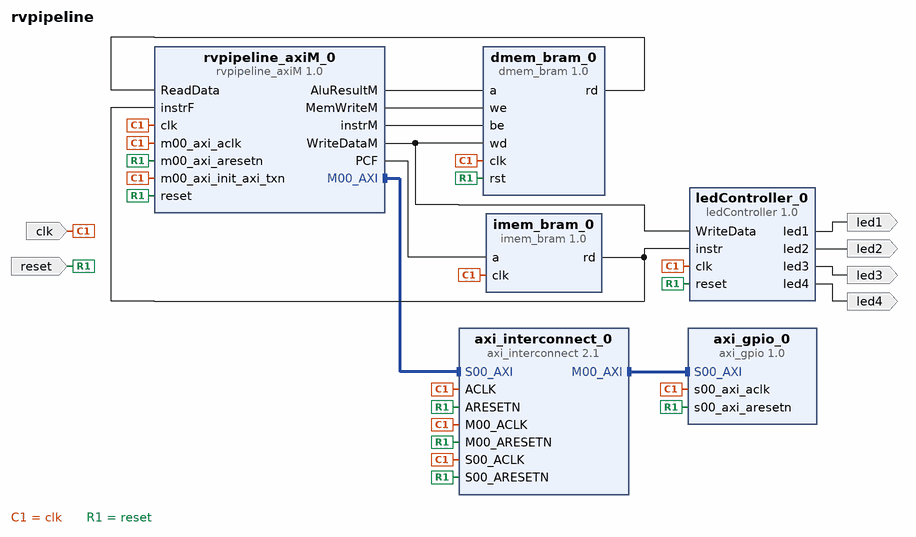
[diagram p0: block diagram of the top level]
# Vivado block design rvpipeline, xc7z010clg400-1, Vivado 2019.2
create_bd_design rvpipeline

create_bd_port -dir I -type clk clk
set_property -dict {CONFIG.FREQ_HZ 50000000} [get_bd_ports clk]
create_bd_port -dir O led3
create_bd_port -dir O led2
create_bd_port -dir O led4
create_bd_port -dir I -type rst reset
set_property -dict {CONFIG.POLARITY ACTIVE_HIGH} [get_bd_ports reset]
create_bd_port -dir O led1

create_bd_cell -type ip -vlnv user.org:user:imem_bram:1.0 imem_bram_0
create_bd_cell -type ip -vlnv user.org:user:dmem_bram:1.0 dmem_bram_0
create_bd_cell -type ip -vlnv xilinx.com:ip:axi_interconnect:2.1 axi_interconnect_0
set_property -dict {CONFIG.NUM_MI 1} [get_bd_cells axi_interconnect_0]
create_bd_cell -type ip -vlnv user.org:user:axi_gpio:1.0 axi_gpio_0
create_bd_cell -type ip -vlnv user.org:user:ledController:1.0 ledController_0
create_bd_cell -type ip -vlnv user.org:user:rvpipeline_axiM:1.0 rvpipeline_axiM_0

# ---- connections ----

connect_bd_intf_net [get_bd_intf_pins axi_interconnect_0/M00_AXI] [get_bd_intf_pins axi_gpio_0/S00_AXI]
connect_bd_intf_net [get_bd_intf_pins rvpipeline_axiM_0/M00_AXI] [get_bd_intf_pins axi_interconnect_0/S00_AXI]
connect_bd_net -net riscvpipeline_0_ALUResultM [get_bd_pins rvpipeline_axiM_0/AluResultM] [get_bd_pins dmem_bram_0/a]
connect_bd_net -net riscvpipeline_0_WriteDataM [get_bd_pins rvpipeline_axiM_0/WriteDataM] \
  [get_bd_pins dmem_bram_0/wd] [get_bd_pins ledController_0/WriteData]
connect_bd_net [get_bd_pins dmem_bram_0/rd] [get_bd_pins rvpipeline_axiM_0/ReadData]
connect_bd_net [get_bd_pins rvpipeline_axiM_0/PCF] [get_bd_pins imem_bram_0/a]
connect_bd_net [get_bd_pins rvpipeline_axiM_0/MemWriteM] [get_bd_pins dmem_bram_0/we]
connect_bd_net [get_bd_pins rvpipeline_axiM_0/instrM] [get_bd_pins dmem_bram_0/be]
connect_bd_net [get_bd_ports clk] \
  [get_bd_pins imem_bram_0/clk] [get_bd_pins axi_interconnect_0/ACLK] [get_bd_pins axi_interconnect_0/M00_ACLK] \
  [get_bd_pins axi_interconnect_0/S00_ACLK] [get_bd_pins dmem_bram_0/clk] [get_bd_pins axi_gpio_0/s00_axi_aclk] \
  [get_bd_pins ledController_0/clk] [get_bd_pins rvpipeline_axiM_0/clk] [get_bd_pins rvpipeline_axiM_0/m00_axi_init_axi_txn] \
  [get_bd_pins rvpipeline_axiM_0/m00_axi_aclk]
connect_bd_net [get_bd_ports reset] \
  [get_bd_pins dmem_bram_0/rst] [get_bd_pins axi_gpio_0/s00_axi_aresetn] [get_bd_pins axi_interconnect_0/ARESETN] \
  [get_bd_pins axi_interconnect_0/S00_ARESETN] [get_bd_pins axi_interconnect_0/M00_ARESETN] \
  [get_bd_pins ledController_0/reset] [get_bd_pins rvpipeline_axiM_0/reset] [get_bd_pins rvpipeline_axiM_0/m00_axi_aresetn]
connect_bd_net [get_bd_pins imem_bram_0/rd] [get_bd_pins ledController_0/instr] [get_bd_pins rvpipeline_axiM_0/instrF]
connect_bd_net [get_bd_pins ledController_0/led1] [get_bd_ports led1]
connect_bd_net [get_bd_pins ledController_0/led2] [get_bd_ports led2]
connect_bd_net [get_bd_pins ledController_0/led3] [get_bd_ports led3]
connect_bd_net [get_bd_pins ledController_0/led4] [get_bd_ports led4]

# ---- address map ----
assign_bd_address -offset 0x40000000 -range 64K -target_address_space [get_bd_addr_spaces rvpipeline_axiM_0/M00_AXI] [get_bd_addr_segs axi_gpio_0/S00_AXI/S00_AXI_reg]

validate_bd_design
save_bd_design
